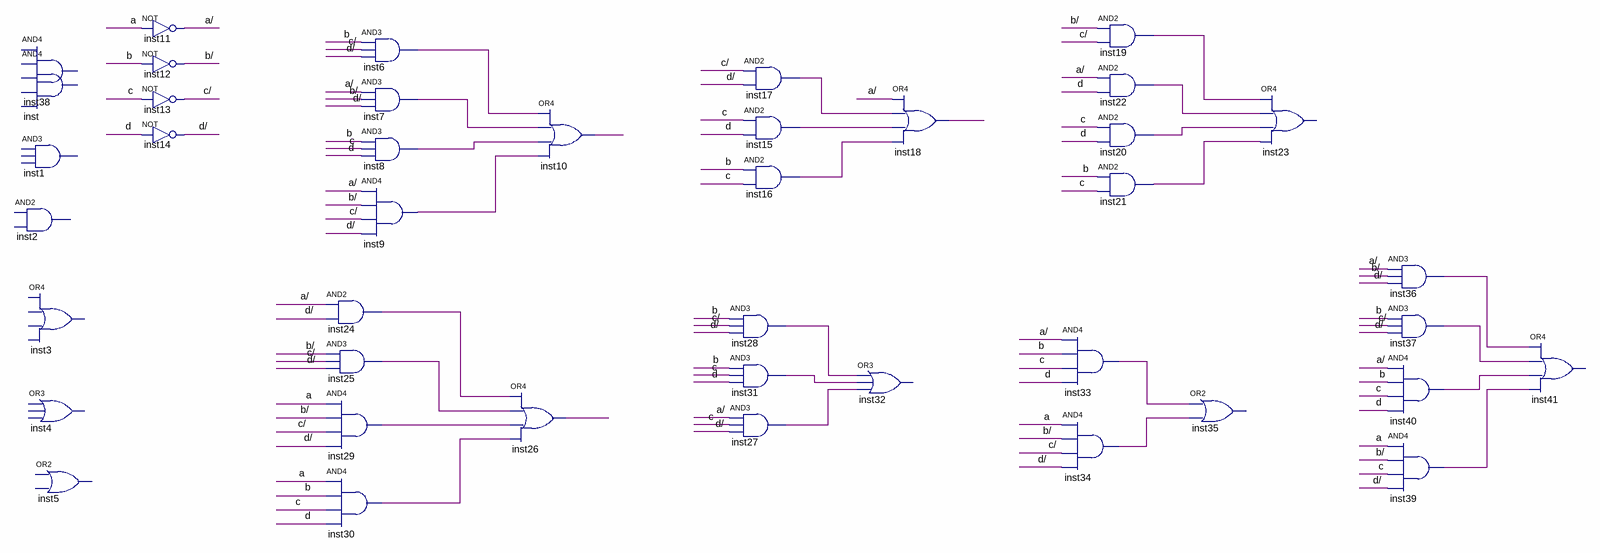
[diagram p0: schematic sheet]
// Quartus schematic Block2.bdf as structural Verilog: 42 symbols, 0 pins
module Block2 (
);

  wire a, \a/ , b, \b/ , c, \c/ , d, \d/ , inst6_out, inst7_out, inst8_out, inst9_out, inst10_out,
       inst15_out, inst16_out, inst17_out, inst18_out, inst19_out, inst20_out, inst21_out, inst22_out,
       inst24_out, inst25_out, inst26_out, inst27_out, inst28_out, inst29_out, inst30_out, inst31_out,
       inst33_out, inst34_out, inst36_out, inst37_out, inst39_out, inst40_out, undriven, undriven_2,
       undriven_3;

  // AND4 inst38 has open pins: IN1=open, IN2=undriven, IN3=undriven_2, IN4=undriven_3, OUT=open
  // AND4 inst has open pins: IN1=undriven, IN2=undriven_2, IN3=undriven_3, IN4=open, OUT=open
  // AND3 inst1 is placed but not wired
  // AND2 inst2 is placed but not wired
  // OR4 inst3 is placed but not wired
  // OR3 inst4 is placed but not wired
  // OR2 inst5 is placed but not wired
  not inst11 (\a/ , a);
  not inst12 (\b/ , b);
  not inst13 (\c/ , c);
  not inst14 (\d/ , d);
  and inst24 (inst24_out, \a/ , \d/ );
  and inst25 (inst25_out, \b/ , \c/ , \d/ );
  and inst29 (inst29_out, a, \b/ , \c/ , \d/ );
  and inst30 (inst30_out, a, b, c, d);
  and inst6 (inst6_out, b, \c/ , \d/ );
  and inst7 (inst7_out, \a/ , \b/ , \d/ );
  and inst8 (inst8_out, b, c, d);
  and inst9 (inst9_out, \a/ , \b/ , \c/ , \d/ );
  or inst10 (inst10_out, inst6_out, inst7_out, inst8_out, inst9_out);
  or inst26 (inst26_out, inst24_out, inst25_out, inst29_out, inst30_out);
  and inst28 (inst28_out, b, \c/ , \d/ );
  and inst31 (inst31_out, b, c, d);
  and inst27 (inst27_out, \a/ , c, \d/ );
  and inst17 (inst17_out, \c/ , \d/ );
  and inst15 (inst15_out, c, d);
  and inst16 (inst16_out, b, c);
  or inst18 (inst18_out, \a/ , inst17_out, inst15_out, inst16_out);
  // OR3 inst32 has open pins: IN1=inst28_out, IN2=inst31_out, IN3=inst27_out, OUT=open
  and inst33 (inst33_out, \a/ , b, c, d);
  and inst34 (inst34_out, a, \b/ , \c/ , \d/ );
  and inst19 (inst19_out, \b/ , \c/ );
  and inst22 (inst22_out, \a/ , d);
  and inst20 (inst20_out, c, d);
  and inst21 (inst21_out, b, c);
  // OR2 inst35 has open pins: IN1=inst33_out, IN2=inst34_out, OUT=open
  // OR4 inst23 has open pins: IN1=inst19_out, IN2=inst22_out, IN3=inst20_out, IN4=inst21_out, OUT=open
  and inst36 (inst36_out, \a/ , \b/ , \d/ );
  and inst37 (inst37_out, b, \c/ , \d/ );
  and inst40 (inst40_out, \a/ , b, c, d);
  and inst39 (inst39_out, a, \b/ , c, \d/ );
  // OR4 inst41 has open pins: IN1=inst36_out, IN2=inst37_out, IN3=inst40_out, IN4=inst39_out, OUT=open
endmodule
